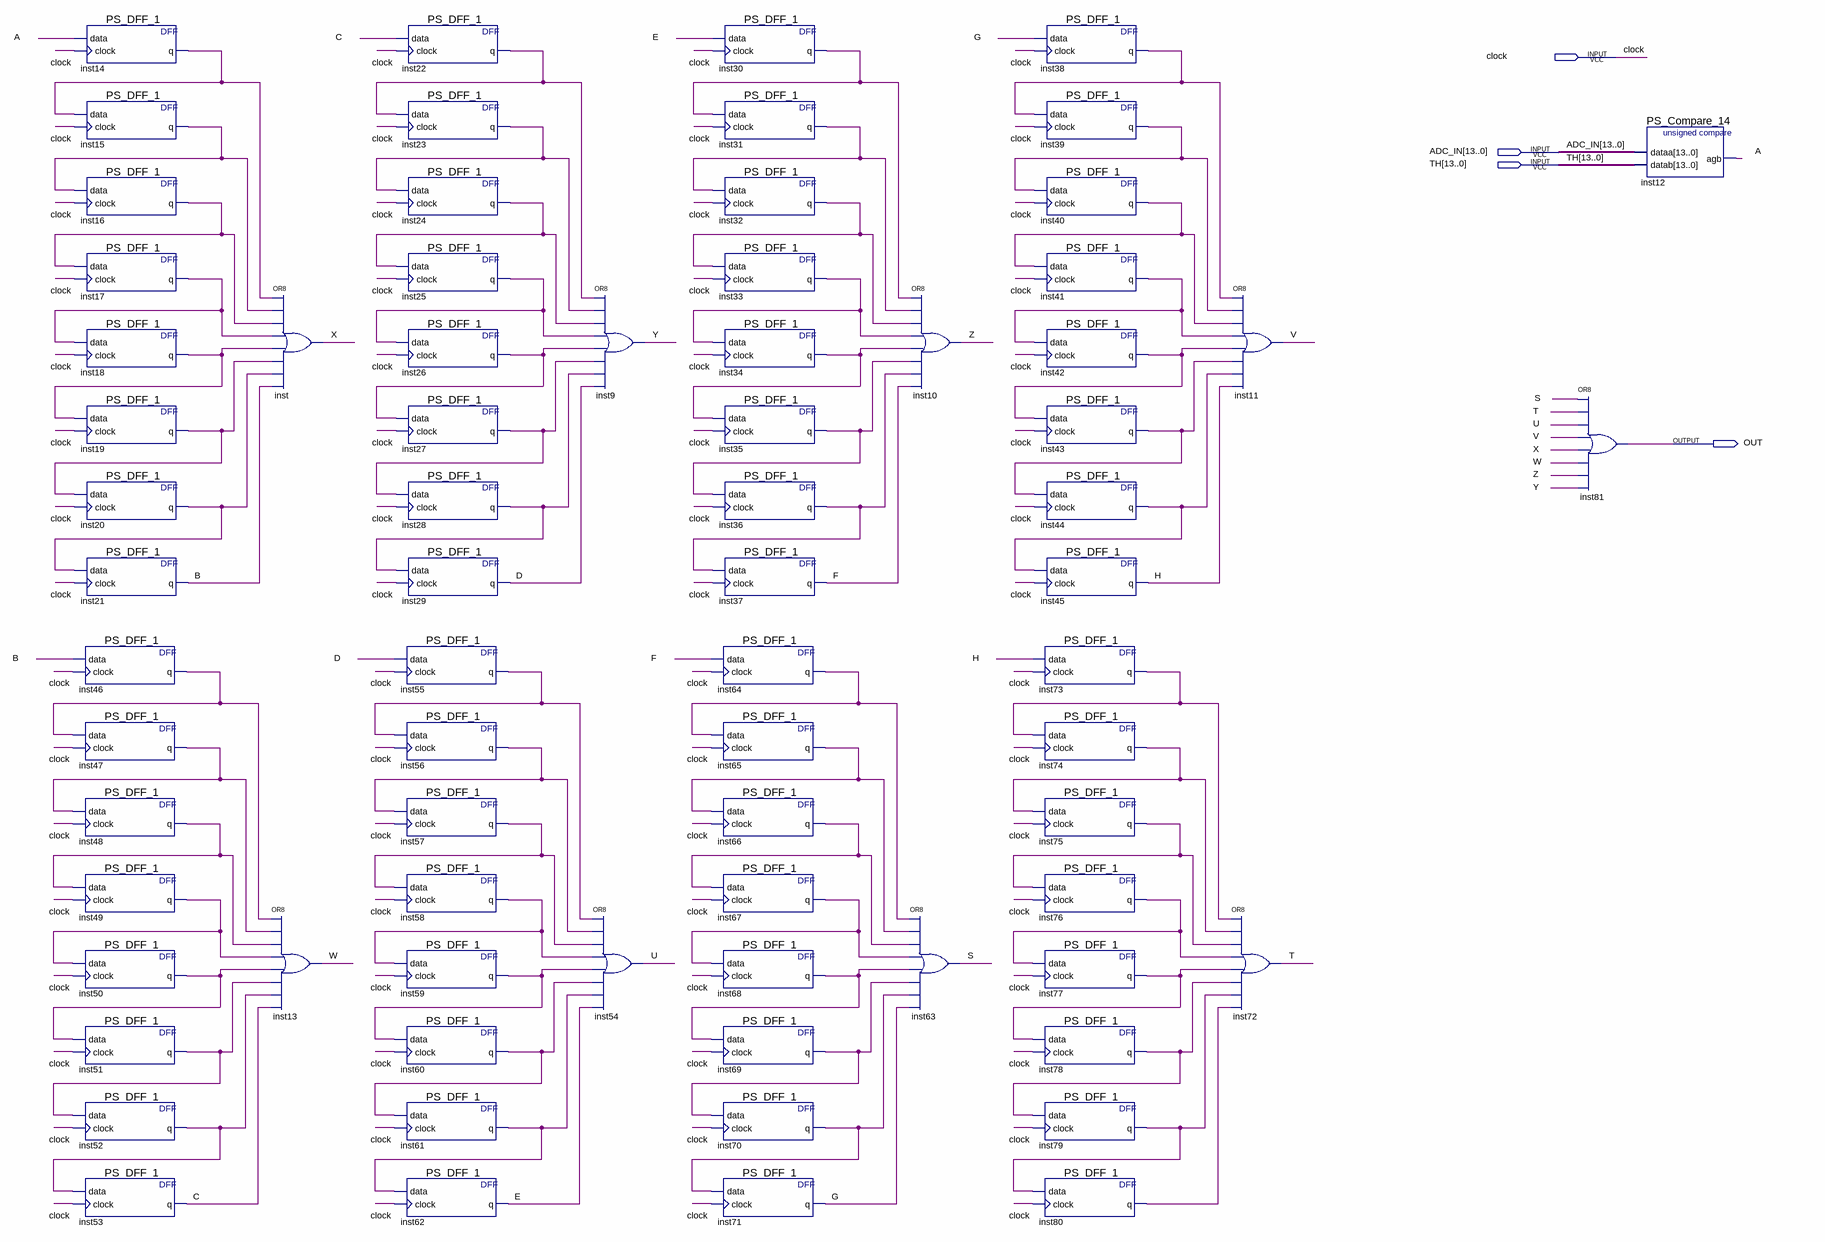
[diagram p0: schematic sheet]
// Quartus schematic CL_Channel.bdf as structural Verilog: 74 symbols, 4 pins
module CL_Channel (
  input  clock,
  input  [13:0] ADC_IN,
  input  [13:0] TH,
  output OUT
);

  wire A, B, C, D, E, F, G, H, inst14_q, inst15_q, inst16_q, inst17_q, inst18_q, inst19_q, inst20_q,
       inst22_q, inst23_q, inst24_q, inst25_q, inst26_q, inst27_q, inst28_q, inst30_q, inst31_q, inst32_q,
       inst33_q, inst34_q, inst35_q, inst36_q, inst38_q, inst39_q, inst40_q, inst41_q, inst42_q, inst43_q,
       inst44_q, inst46_q, inst47_q, inst48_q, inst49_q, inst50_q, inst51_q, inst52_q, inst55_q, inst56_q,
       inst57_q, inst58_q, inst59_q, inst60_q, inst61_q, inst64_q, inst65_q, inst66_q, inst67_q, inst68_q,
       inst69_q, inst70_q, inst73_q, inst74_q, inst75_q, inst76_q, inst77_q, inst78_q, inst79_q, inst80_q, S,
       T, U, V, W, X, Y, Z;

  PS_DFF_1 inst14 (.data(A), .clock(clock), .q(inst14_q));
  PS_DFF_1 inst15 (.data(inst14_q), .clock(clock), .q(inst15_q));
  PS_DFF_1 inst16 (.data(inst15_q), .clock(clock), .q(inst16_q));
  PS_DFF_1 inst17 (.data(inst16_q), .clock(clock), .q(inst17_q));
  PS_DFF_1 inst18 (.data(inst17_q), .clock(clock), .q(inst18_q));
  PS_DFF_1 inst19 (.data(inst18_q), .clock(clock), .q(inst19_q));
  PS_DFF_1 inst20 (.data(inst19_q), .clock(clock), .q(inst20_q));
  PS_DFF_1 inst21 (.data(inst20_q), .clock(clock), .q(B));
  PS_DFF_1 inst46 (.data(B), .clock(clock), .q(inst46_q));
  PS_DFF_1 inst47 (.data(inst46_q), .clock(clock), .q(inst47_q));
  PS_DFF_1 inst48 (.data(inst47_q), .clock(clock), .q(inst48_q));
  PS_DFF_1 inst49 (.data(inst48_q), .clock(clock), .q(inst49_q));
  PS_DFF_1 inst50 (.data(inst49_q), .clock(clock), .q(inst50_q));
  PS_DFF_1 inst51 (.data(inst50_q), .clock(clock), .q(inst51_q));
  PS_DFF_1 inst52 (.data(inst51_q), .clock(clock), .q(inst52_q));
  PS_DFF_1 inst53 (.data(inst52_q), .clock(clock), .q(C));
  or inst (X, inst14_q, inst15_q, inst16_q, inst17_q, inst18_q, inst19_q, inst20_q, B);
  or inst13 (W, inst46_q, inst47_q, inst48_q, inst49_q, inst50_q, inst51_q, inst52_q, C);
  PS_DFF_1 inst22 (.data(C), .clock(clock), .q(inst22_q));
  PS_DFF_1 inst23 (.data(inst22_q), .clock(clock), .q(inst23_q));
  PS_DFF_1 inst24 (.data(inst23_q), .clock(clock), .q(inst24_q));
  PS_DFF_1 inst25 (.data(inst24_q), .clock(clock), .q(inst25_q));
  PS_DFF_1 inst26 (.data(inst25_q), .clock(clock), .q(inst26_q));
  PS_DFF_1 inst27 (.data(inst26_q), .clock(clock), .q(inst27_q));
  PS_DFF_1 inst28 (.data(inst27_q), .clock(clock), .q(inst28_q));
  PS_DFF_1 inst29 (.data(inst28_q), .clock(clock), .q(D));
  PS_DFF_1 inst55 (.data(D), .clock(clock), .q(inst55_q));
  PS_DFF_1 inst56 (.data(inst55_q), .clock(clock), .q(inst56_q));
  PS_DFF_1 inst57 (.data(inst56_q), .clock(clock), .q(inst57_q));
  PS_DFF_1 inst58 (.data(inst57_q), .clock(clock), .q(inst58_q));
  PS_DFF_1 inst59 (.data(inst58_q), .clock(clock), .q(inst59_q));
  PS_DFF_1 inst60 (.data(inst59_q), .clock(clock), .q(inst60_q));
  PS_DFF_1 inst61 (.data(inst60_q), .clock(clock), .q(inst61_q));
  PS_DFF_1 inst62 (.data(inst61_q), .clock(clock), .q(E));
  or inst9 (Y, inst22_q, inst23_q, inst24_q, inst25_q, inst26_q, inst27_q, inst28_q, D);
  or inst54 (U, inst55_q, inst56_q, inst57_q, inst58_q, inst59_q, inst60_q, inst61_q, E);
  PS_DFF_1 inst30 (.data(E), .clock(clock), .q(inst30_q));
  PS_DFF_1 inst31 (.data(inst30_q), .clock(clock), .q(inst31_q));
  PS_DFF_1 inst32 (.data(inst31_q), .clock(clock), .q(inst32_q));
  PS_DFF_1 inst33 (.data(inst32_q), .clock(clock), .q(inst33_q));
  PS_DFF_1 inst34 (.data(inst33_q), .clock(clock), .q(inst34_q));
  PS_DFF_1 inst35 (.data(inst34_q), .clock(clock), .q(inst35_q));
  PS_DFF_1 inst36 (.data(inst35_q), .clock(clock), .q(inst36_q));
  PS_DFF_1 inst37 (.data(inst36_q), .clock(clock), .q(F));
  PS_DFF_1 inst64 (.data(F), .clock(clock), .q(inst64_q));
  PS_DFF_1 inst65 (.data(inst64_q), .clock(clock), .q(inst65_q));
  PS_DFF_1 inst66 (.data(inst65_q), .clock(clock), .q(inst66_q));
  PS_DFF_1 inst67 (.data(inst66_q), .clock(clock), .q(inst67_q));
  PS_DFF_1 inst68 (.data(inst67_q), .clock(clock), .q(inst68_q));
  PS_DFF_1 inst69 (.data(inst68_q), .clock(clock), .q(inst69_q));
  PS_DFF_1 inst70 (.data(inst69_q), .clock(clock), .q(inst70_q));
  PS_DFF_1 inst71 (.data(inst70_q), .clock(clock), .q(G));
  or inst10 (Z, inst30_q, inst31_q, inst32_q, inst33_q, inst34_q, inst35_q, inst36_q, F);
  or inst63 (S, inst64_q, inst65_q, inst66_q, inst67_q, inst68_q, inst69_q, inst70_q, G);
  PS_DFF_1 inst38 (.data(G), .clock(clock), .q(inst38_q));
  PS_DFF_1 inst39 (.data(inst38_q), .clock(clock), .q(inst39_q));
  PS_DFF_1 inst40 (.data(inst39_q), .clock(clock), .q(inst40_q));
  PS_DFF_1 inst41 (.data(inst40_q), .clock(clock), .q(inst41_q));
  PS_DFF_1 inst42 (.data(inst41_q), .clock(clock), .q(inst42_q));
  PS_DFF_1 inst43 (.data(inst42_q), .clock(clock), .q(inst43_q));
  PS_DFF_1 inst44 (.data(inst43_q), .clock(clock), .q(inst44_q));
  PS_DFF_1 inst45 (.data(inst44_q), .clock(clock), .q(H));
  PS_DFF_1 inst73 (.data(H), .clock(clock), .q(inst73_q));
  PS_DFF_1 inst74 (.data(inst73_q), .clock(clock), .q(inst74_q));
  PS_DFF_1 inst75 (.data(inst74_q), .clock(clock), .q(inst75_q));
  PS_DFF_1 inst76 (.data(inst75_q), .clock(clock), .q(inst76_q));
  PS_DFF_1 inst77 (.data(inst76_q), .clock(clock), .q(inst77_q));
  PS_DFF_1 inst78 (.data(inst77_q), .clock(clock), .q(inst78_q));
  PS_DFF_1 inst79 (.data(inst78_q), .clock(clock), .q(inst79_q));
  PS_DFF_1 inst80 (.data(inst79_q), .clock(clock), .q(inst80_q));
  or inst11 (V, inst38_q, inst39_q, inst40_q, inst41_q, inst42_q, inst43_q, inst44_q, H);
  or inst72 (T, inst73_q, inst74_q, inst75_q, inst76_q, inst77_q, inst78_q, inst79_q, inst80_q);
  or inst81 (OUT, S, T, U, V, X, W, Z, Y);
  PS_Compare_14 inst12 (.dataa(ADC_IN), .datab(TH), .agb(A));
endmodule
